# Altium project FOREIGNEXCHANGEDISPLAY.PRJPCB
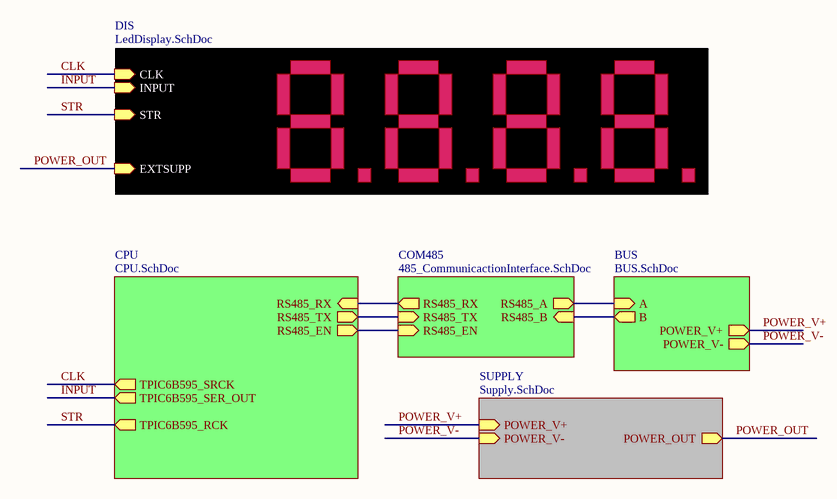
[diagram p0: BuySellDisplay.SchDoc]
13 sheets, 224 parts. Net scope: hierarchical (ports join the sheet entries above them; power ports are global).
Sheets:
  BuySellDisplay.SchDoc
    CPU = CPU.SchDoc
    COM485 = 485_CommunicactionInterface.SchDoc
    DIS = LedDisplay.SchDoc
      7SEG = Led7Seg.SchDoc
        L = Line.SchDoc
        L = Line.SchDoc
        L = Line.SchDoc
        L = Line.SchDoc
        L = Line.SchDoc
        L = Line.SchDoc
        L = Line.SchDoc
        REG = TPIC6B595_CommunicationInterface.SchDoc
      7SEG = Led7Seg.SchDoc
        L = Line.SchDoc
        L = Line.SchDoc
        L = Line.SchDoc
        L = Line.SchDoc
        L = Line.SchDoc
        L = Line.SchDoc
        L = Line.SchDoc
        REG = TPIC6B595_CommunicationInterface.SchDoc
      7SEG = Led7Seg.SchDoc
        L = Line.SchDoc
        L = Line.SchDoc
        L = Line.SchDoc
        L = Line.SchDoc
        L = Line.SchDoc
        L = Line.SchDoc
        L = Line.SchDoc
        REG = TPIC6B595_CommunicationInterface.SchDoc
      7SEG = Led7Seg.SchDoc
        L = Line.SchDoc
        L = Line.SchDoc
        L = Line.SchDoc
        L = Line.SchDoc
        L = Line.SchDoc
        L = Line.SchDoc
        L = Line.SchDoc
        REG = TPIC6B595_CommunicationInterface.SchDoc
    BUS = BUS.SchDoc
      BUS = BUSConnector.SchDoc
      BUS = BUSConnector.SchDoc
    SUPPLY = Supply.SchDoc
  SN54LS145N_CommunicationInterface.SchDoc
  Indicator.SchDoc
  Dot.SchDoc

## Sheet BuySellDisplay.SchDoc
size A4

### Sub-sheets
BUS = BUS.SchDoc: A (in), B (out), POWER_V+ (out), POWER_V- (out)
COM485 = 485_CommunicactionInterface.SchDoc: RS485_RX (out), RS485_TX (in), RS485_EN (in), RS485_A (out), RS485_B (in)
CPU = CPU.SchDoc: RS485_RX (in), RS485_TX (out), RS485_EN (out), TPIC6B595_SRCK (out), TPIC6B595_SER_OUT (out), TPIC6B595_RCK (out)
DIS = LedDisplay.SchDoc: CLK (in), INPUT (in), STR (in), EXTSUPP (in)
SUPPLY = Supply.SchDoc: POWER_V+ (in), POWER_V- (in), POWER_OUT (out)

### Nets
A: sheet COM485/RS485_A, sheet BUS/A
B: sheet COM485/RS485_B, sheet BUS/B
CLK: sheet CPU/TPIC6B595_SRCK, sheet DIS/CLK
COM_485_EN: sheet CPU/RS485_EN, sheet COM485/RS485_EN
DI: sheet CPU/RS485_TX, sheet COM485/RS485_TX
INPUT: sheet CPU/TPIC6B595_SER_OUT, sheet DIS/INPUT
POWER_OUT: sheet DIS/EXTSUPP, sheet SUPPLY/POWER_OUT  [project net EXTSUPP]
POWER_V+: sheet BUS/POWER_V+, sheet SUPPLY/POWER_V+
POWER_V-: sheet BUS/POWER_V-, sheet SUPPLY/POWER_V-
RO: sheet CPU/RS485_RX, sheet COM485/RS485_RX
STR: sheet CPU/TPIC6B595_RCK, sheet DIS/STR  [project net RCK]

## Sheet CPU.SchDoc
size A4
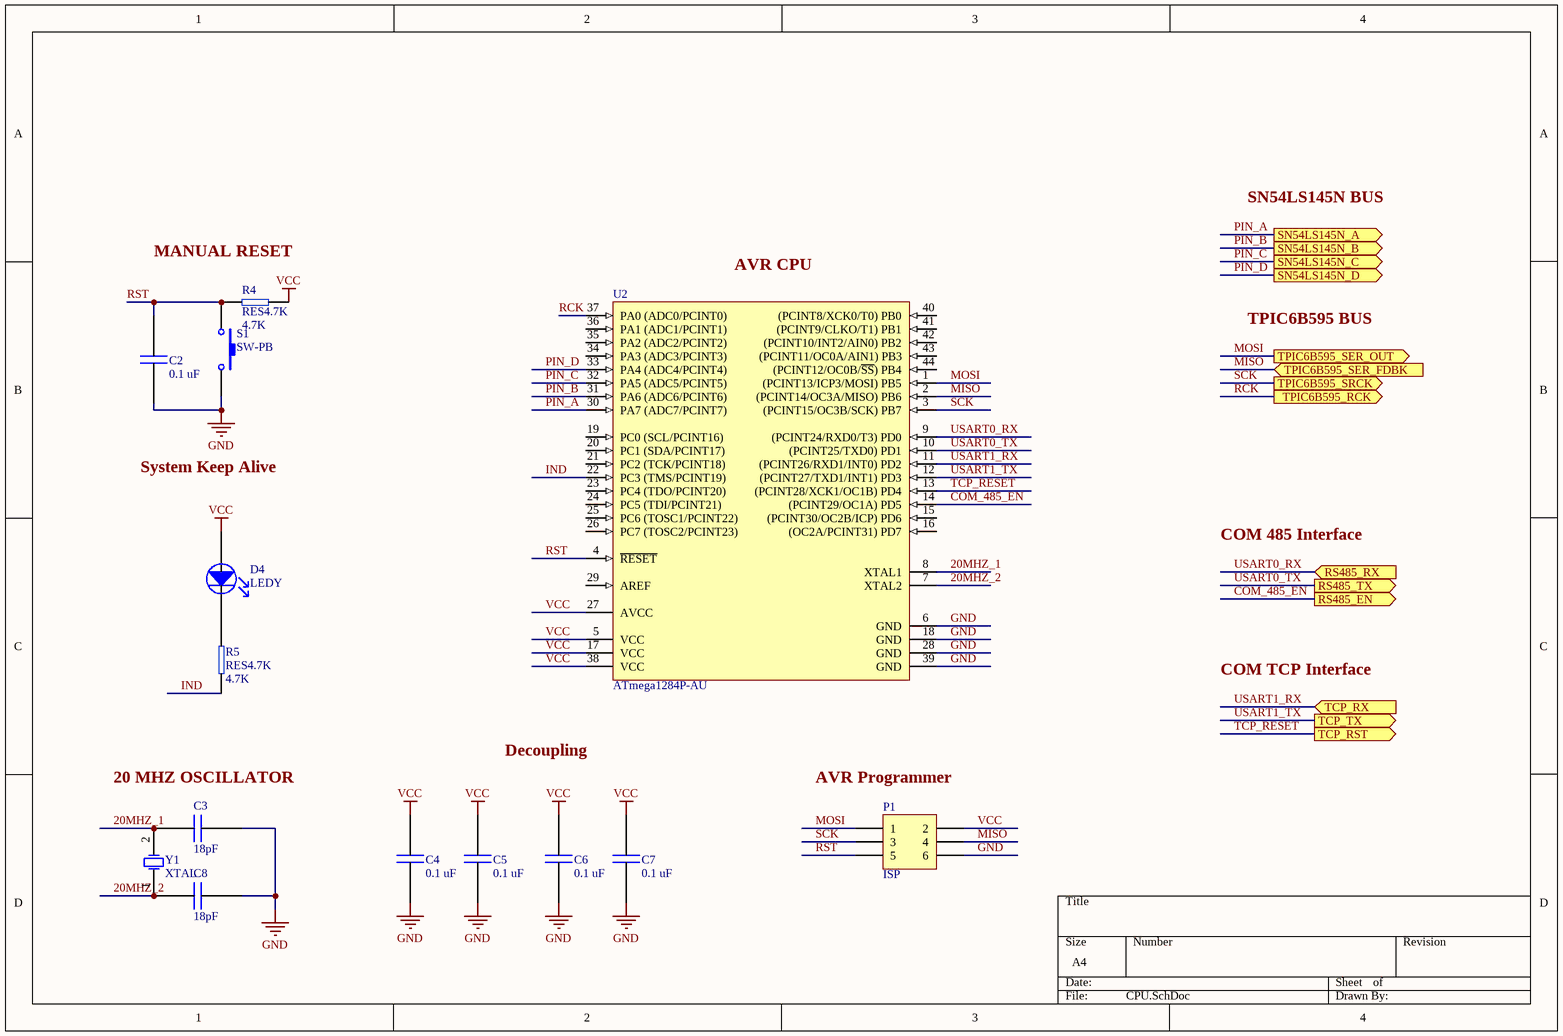
[diagram p1: CPU.SchDoc]

### Parts
C2  value 0.1 uF  [CAP0603]  (hidden comment: CAP0.1uF)
C3  value 18pF  [CAP0603]  (hidden comment: CAP18pF)
C4  value 0.1 uF  [CAP0603]  (hidden comment: CAP0.1uF)
C5  value 0.1 uF  [CAP0603]  (hidden comment: CAP0.1uF)
C6  value 0.1 uF  [CAP0603]  (hidden comment: CAP0.1uF)
C7  value 0.1 uF  [CAP0603]  (hidden comment: CAP0.1uF)
C8  value 18pF  [CAP0603]  (hidden comment: CAP18pF)
D4  LEDY  [150060YS75000]
P1  ISP  [HDR2X3]
R4  RES4.7K  value 4.7K  [RES0603]
R5  RES4.7K  value 4.7K  [RES0603]
S1  SW-PB  [microswitch]
U2  ATmega1284P-AU  [44A_N]
Y1  XTAL  [Crystal20MHz]

### Ports
RS485_EN (out), RS485_RX (in), RS485_TX (out), SN54LS145N_A (out), SN54LS145N_B (out), SN54LS145N_C (out), SN54LS145N_D (out), TCP_RST (out), TCP_RX (in), TCP_TX (out), TPIC6B595_RCK (out), TPIC6B595_SER_FDBK (in), TPIC6B595_SER_OUT (out), TPIC6B595_SRCK (out)

### Nets
GND: C2.2 C3.2 C4.2 C5.2 C6.2 C7.2 C8.2 P1.6 S1.2 U2.6(GND) U2.18(GND) U2.28(GND) U2.39(GND)
VCC: C4.1 C5.1 C6.1 C7.1 D4.2(Anode) P1.2 R4.2(neg) U2.5(VCC) U2.17(VCC) U2.27(AVCC) U2.38(VCC)
20MHZ_1: C3.1 U2.8(XTAL1) Y1.2(OSC2)
20MHZ_2: C8.1 U2.7(XTAL2) Y1.1(OSC1)
COM_485_EN: U2.14((PCINT29/OC1A)_PD5) ; port RS485_EN
IND: R5.1(pos) U2.22(PC3_(TMS/PCINT19))
MISO: P1.4 U2.2((PCINT14/OC3A/MISO)_PB6) ; port TPIC6B595_SER_FDBK
MOSI: P1.1 U2.1((PCINT13/ICP3/MOSI)_PB5) ; port TPIC6B595_SER_OUT  [project net INPUT]
PIN_A: U2.30(PA7_(ADC7/PCINT7)) ; port SN54LS145N_A
PIN_B: U2.31(PA6_(ADC6/PCINT6)) ; port SN54LS145N_B
PIN_C: U2.32(PA5_(ADC5/PCINT5)) ; port SN54LS145N_C
PIN_D: U2.33(PA4_(ADC4/PCINT4)) ; port SN54LS145N_D
RCK: U2.37(PA0_(ADC0/PCINT0)) ; port TPIC6B595_RCK
RST: C2.1 P1.5 R4.1(pos) S1.1 U2.4(~{RESET})
SCK: P1.3 U2.3((PCINT15/OC3B/SCK)_PB7) ; port TPIC6B595_SRCK  [project net CLK]
TCP_RESET: U2.13((PCINT28/XCK1/OC1B)_PD4) ; port TCP_RST
USART0_RX: U2.9((PCINT24/RXD0/T3)_PD0) ; port RS485_RX  [project net RO]
USART0_TX: U2.10((PCINT25/TXD0)_PD1) ; port RS485_TX  [project net DI]
USART1_RX: U2.11((PCINT26/RXD1/INT0)_PD2) ; port TCP_RX
USART1_TX: U2.12((PCINT27/TXD1/INT1)_PD3) ; port TCP_TX
NetD4_1: D4.1(Cathode) R5.2(neg)

Not connected (* = marked no-connect by the designer): U2 15((PCINT30/OC2B/ICP)_PD6) 16((OC2A/PCINT31)_PD7) 19(PC0_(SCL/PCINT16)) 20(PC1_(SDA/PCINT17)) 21(PC2_(TCK/PCINT18)) 23(PC4_(TDO/PCINT20)) 24(PC5_(TDI/PCINT21)) 25(PC6_(TOSC1/PCINT22)) 26(PC7_(TOSC2/PCINT23)) 29(AREF) 34(PA3_(ADC3/PCINT3)) 35(PA2_(ADC2/PCINT2)) 36(PA1_(ADC1/PCINT1)) 40((PCINT8/XCK0/T0)_PB0) 41((PCINT9/CLKO/T1)_PB1) 42((PCINT10/INT2/AIN0)_PB2) 43((PCINT11/OC0A/AIN1)_PB3) 44((PCINT12/OC0B/~{SS})_PB4)

### Notes on the sheet
- Labels drawn without touching a wire or pin: 20 MHZ OSCILLATOR, AVR CPU, AVR Programmer, COM 485 Interface, COM TCP Interface, Decoupling, MANUAL RESET, SN54LS145N BUS, System Keep Alive, TPIC6B595 BUS

### Library data of the parts
C2 C4-C7 = C0.1UF: Capacitores cerámicos de capas múltiples (MLCC) - SMD/SMT 0603 0.1uF 16volts X7R 5%; MPN: VJ0603Y104JXJPW1BC; Supplier PN: 77-VJ0603Y104JXJPBC; Supplier: Mouser
C3 C8 = CAP18pF: Capacitores cerámicos de capas múltiples (MLCC) - SMD/SMT 0603 18pF 50volts C0G 5%; MPN: GRM1885C1H180JA01D; Supplier: Mouser; Supplier PN: 81-GRM39C180J50
D4 = LEDY: LED estándar - SMD (montaje superficial) WL-SMCW SMDMono TpVw Waterclr 0603 Yellow; Supplier: Mouser; Supplier PN: 710-150060YS75000; MPN: 150060YS75000; Value: Yellow
P1 = Header 3X2: Alojamientos de cables y cabecera 2X03P DUAL ROW; MPN: 826925-3; Value: 6 POS; Supplier: Mouser; Supplier PN: 571-826925-3
R4 R5 = RES4.7K: Resistores de película gruesa - SMD 1/10watt 4.7Kohms 1%; MPN: CRCW06034K70FKEA; Supplier PN: 71-CRCW0603-4.7K-E3; Supplier: Mouser
S1 = SW-PB: Switch; MPN: PTS635SL43SMTR LFS; Value: OFF - (ON); Supplier: Mouser; Supplier PN: 611-PTS635SL43SMTRLF
U2 = ATmega1284P-AU: 20 MHz 8-bit AVR Microcontroller with 128KB Flash, 44-Pin TQFP Pkg, Industrial Temp; Supplier: Mouser; Supplier PN: 556-ATMEGA1284P-AU; MPN: ATMEGA1284P-AU; Value: ATMEGA1284P
Y1 = XTAL: Cristales 20MHz 16pF -10C +70C; MPN: ECS-200-16-5PX-TR; Supplier: Mouser; Supplier PN: 520-ECS-200-16-5PX-T; Value: 20 MHz

## Sheet 485_CommunicactionInterface.SchDoc
size A4
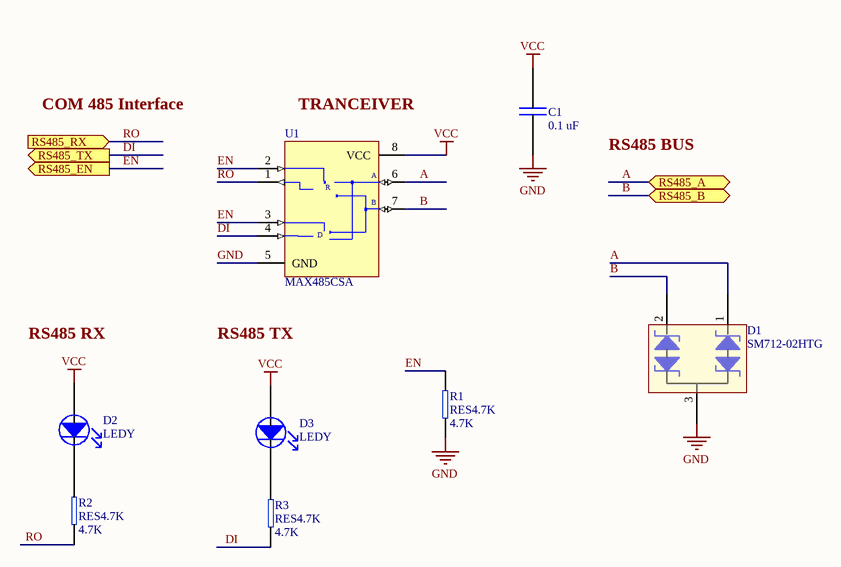
[diagram p2: 485_CommunicactionInterface.SchDoc]

### Parts
C1  value 0.1 uF  [CAP0603]  (hidden comment: CAP0.1uF)
D1  SM712-02HTG  [SW712]
D2  LEDY  [150060YS75000]
D3  LEDY  [150060YS75000]
R1  RES4.7K  value 4.7K  [RES0603]
R2  RES4.7K  value 4.7K  [RES0603]
R3  RES4.7K  value 4.7K  [RES0603]
U1  MAX485CSA  [NSO8_N]

### Ports
RS485_A (bidir), RS485_B (bidir), RS485_EN (out), RS485_RX (in), RS485_TX (out)

### Nets
GND: C1.2 D1.3 R1.2(neg) U1.5(GND)
VCC: C1.1 D2.2(Anode) D3.2(Anode) U1.8(VCC)
A: D1.1 U1.6(A) ; port RS485_A
B: D1.2 U1.7(B) ; port RS485_B
DI: R3.2(neg) U1.4(DI) ; port RS485_TX
EN: R1.1(pos) U1.2(~{RE}) U1.3(DE) ; port RS485_EN  [project net COM_485_EN]
RO: R2.2(neg) U1.1(RO) ; port RS485_RX
NetD2_1: D2.1(Cathode) R2.1(pos)
NetD3_1: D3.1(Cathode) R3.1(pos)

### Notes on the sheet
- Labels drawn without touching a wire or pin: COM 485 Interface, RS485 BUS, RS485 RX, RS485 TX, TRANCEIVER
- (in symbol MAX485CSA) R; D

### Library data of the parts
C1 = C0.1UF: as C2 on sheet CPU; Supplier PN: 77-VJ0603Y104JXJPBC; Supplier: Mouser
D1 = SM712-02HTG: Secuencias de diodos de TVS 600W 2 Channel Green Asymmetrical SOT23-3 (- 7 V to + 12 V); Supplier: Mouser; Supplier PN: 576-SM712-02HTG; MPN: SM712-02HTG; Value: TVS 600W
D2 D3 = LEDY: as D4 on sheet CPU; Supplier: Mouser; Supplier PN: 710-150060YS75000; MPN: 150060YS75000; Value: Yellow
R1-R3 = RES4.7K: as R4 on sheet CPU; Supplier PN: 71-CRCW0603-4.7K-E3; Supplier: Mouser
U1 = MAX485CSA: Low-Power, Slew-Rate-Limited RS-485/RS-422 Transceiver; MPN: MAX485CSA+; Value: RS485; Supplier: Mouser; Supplier PN: 700-MAX485CSA

## Sheet LedDisplay.SchDoc
size A4
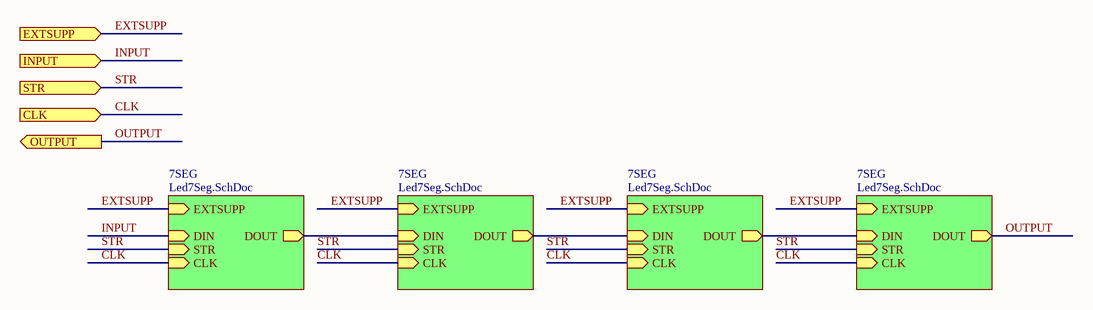
[diagram p3: LedDisplay.SchDoc]

### Sub-sheets
7SEG = Led7Seg.SchDoc: DIN (in), STR (in), CLK (in), DOUT (out), EXTSUPP (in)
7SEG = Led7Seg.SchDoc: DIN (in), STR (in), CLK (in), DOUT (out), EXTSUPP (in)
7SEG = Led7Seg.SchDoc: DIN (in), STR (in), CLK (in), DOUT (out), EXTSUPP (in)
7SEG = Led7Seg.SchDoc: DIN (in), STR (in), CLK (in), DOUT (out), EXTSUPP (in)

### Ports
CLK (in), EXTSUPP (in), INPUT (in), OUTPUT (out), STR (in)

### Nets
CLK: port CLK, sheet 7SEG/CLK, sheet 7SEG/CLK, sheet 7SEG/CLK, sheet 7SEG/CLK
EXTSUPP: port EXTSUPP, sheet 7SEG/EXTSUPP, sheet 7SEG/EXTSUPP, sheet 7SEG/EXTSUPP, sheet 7SEG/EXTSUPP
INPUT: port INPUT, sheet 7SEG/DIN
OUTPUT: port OUTPUT, sheet 7SEG/DOUT
STR: port STR, sheet 7SEG/STR, sheet 7SEG/STR, sheet 7SEG/STR, sheet 7SEG/STR  [project net RCK]
NetU3_DIS_7SEG_REG#1_9: sheet 7SEG/DOUT, sheet 7SEG/DIN
NetU3_DIS_7SEG_REG#2_9: sheet 7SEG/DOUT, sheet 7SEG/DIN
NetU3_DIS_7SEG_REG#3_9: sheet 7SEG/DOUT, sheet 7SEG/DIN

## Sheet Led7Seg.SchDoc
size A4
Used 4 times, as channels DIS/7SEG, DIS/7SEG, DIS/7SEG, DIS/7SEG. Parts and nets are listed once, with the designators drawn on the sheet.
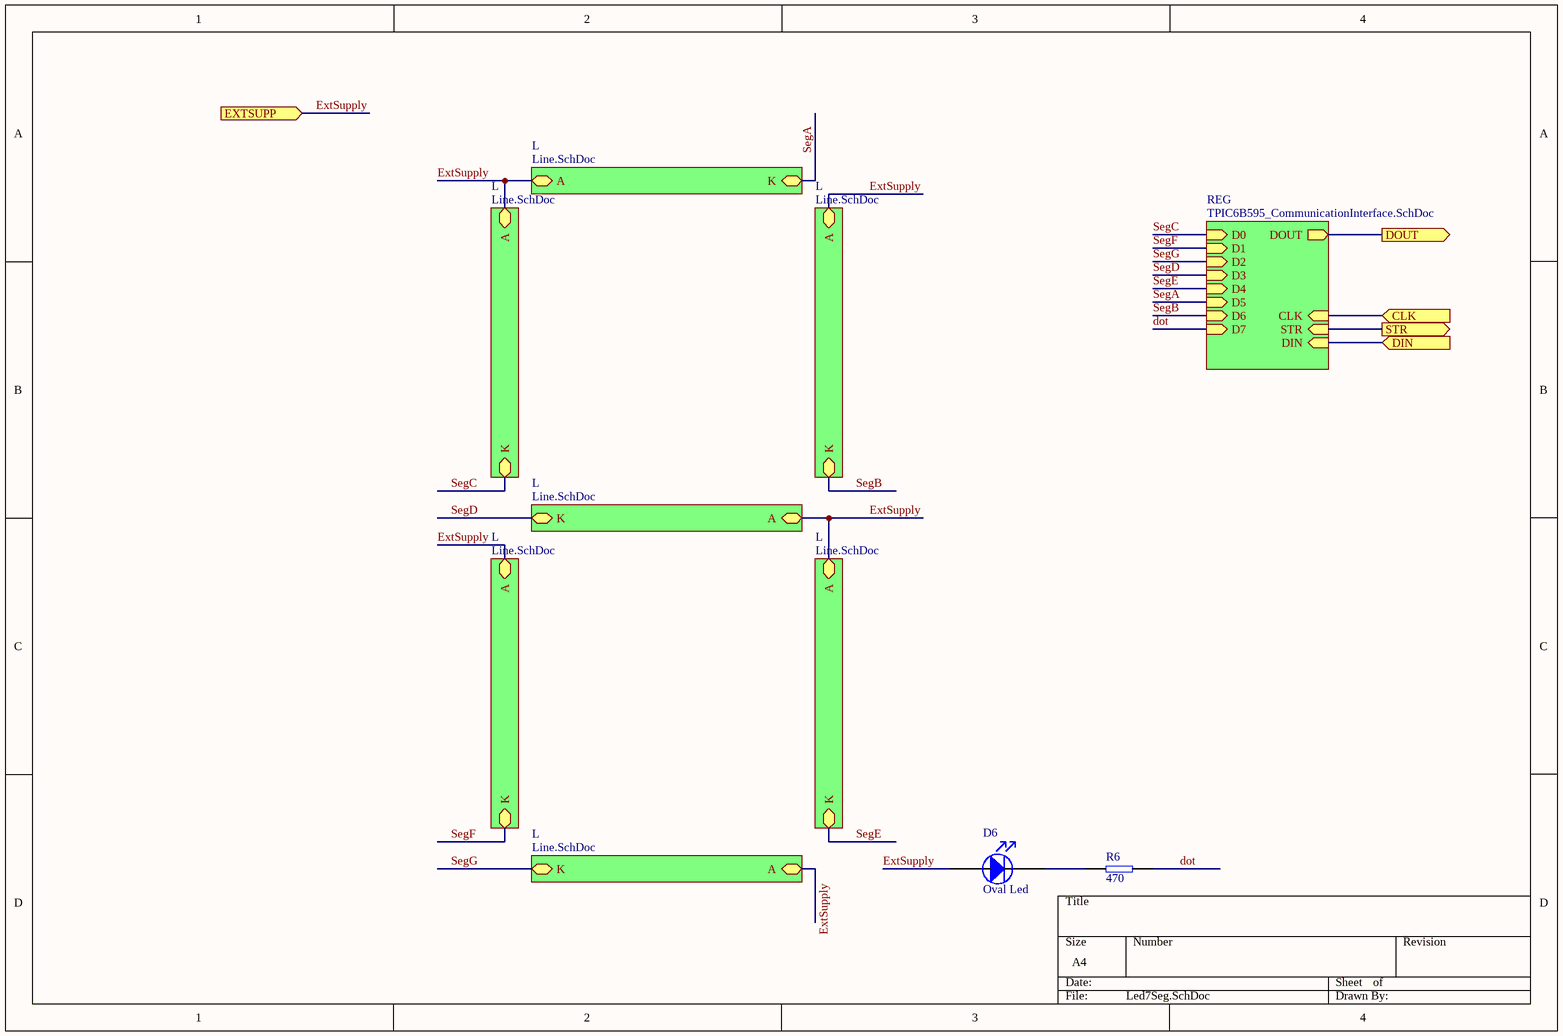
[diagram p4: Led7Seg.SchDoc]

### Parts
D6  Oval Led  [LED]
R6  value 470  [RES2512]  (hidden comment: RES470)

### Sub-sheets
L = Line.SchDoc: A, K
L = Line.SchDoc: A, K
L = Line.SchDoc: A, K
L = Line.SchDoc: A, K
L = Line.SchDoc: A, K
L = Line.SchDoc: A, K
L = Line.SchDoc: A, K
REG = TPIC6B595_CommunicationInterface.SchDoc: D0 (in), D1 (in), D2 (in), D3 (in), D4 (in), D5 (in), D6 (in), D7 (in), DIN (in), DOUT (out), STR (in), CLK (in)

### Ports
CLK (in), DIN (in), DOUT (out), EXTSUPP (in), STR (out)

### Nets
CLK: port CLK, sheet REG/CLK
DIN: port DIN, sheet REG/DIN
dot: R6.2(neg) ; sheet REG/D7
DOUT: port DOUT, sheet REG/DOUT
ExtSupply: D6.A(Anode) ; port EXTSUPP, sheet L/A, sheet L/A, sheet L/A, sheet L/A, sheet L/A, sheet L/A, sheet L/A
SegA: sheet L/K, sheet REG/D5
SegB: sheet L/K, sheet REG/D6
SegC: sheet L/K, sheet REG/D0
SegD: sheet L/K, sheet REG/D3
SegE: sheet L/K, sheet REG/D4
SegF: sheet L/K, sheet REG/D1
SegG: sheet L/K, sheet REG/D2
STR: port STR, sheet REG/STR
NetD6_K: D6.K(Cathode) R6.1(pos)

### Channels
DIS/7SEG: designators end in _DIS_7SEG#1; ports CLK=CLK DIN=INPUT DOUT=NetU3_DIS_7SEG_REG#1_9 EXTSUPP=EXTSUPP STR=RCK
DIS/7SEG: designators end in _DIS_7SEG#2; ports CLK=CLK DIN=NetU3_DIS_7SEG_REG#1_9 DOUT=NetU3_DIS_7SEG_REG#2_9 EXTSUPP=EXTSUPP STR=RCK
DIS/7SEG: designators end in _DIS_7SEG#3; ports CLK=CLK DIN=NetU3_DIS_7SEG_REG#2_9 DOUT=NetU3_DIS_7SEG_REG#3_9 EXTSUPP=EXTSUPP STR=RCK
DIS/7SEG: designators end in _DIS_7SEG#4; ports CLK=CLK DIN=NetU3_DIS_7SEG_REG#3_9 DOUT=OUTPUT EXTSUPP=EXTSUPP STR=RCK

### Library data of the parts
D6 = Oval Led: LED estándar - Montaje interfacial Red Oval LED; MPN: C566C-RFN-CV0W0BB2; Value: 2200 mcd 70x35 deg; Supplier: Mouser; Supplier PN: 941-C566CRFNCV0W0BB2
R6 = RES470: Resistores de película gruesa - SMD 1watt 470ohms 5%; MPN: CRCW2512470RJNEG; Supplier: Mouser; Supplier PN: 71-CRCW2512J-470-E3

## Sheet Line.SchDoc
size A4
Used 28 times, as channels DIS/7SEG/L, DIS/7SEG/L, DIS/7SEG/L, DIS/7SEG/L, DIS/7SEG/L, DIS/7SEG/L, DIS/7SEG/L, DIS/7SEG/L, DIS/7SEG/L, DIS/7SEG/L, DIS/7SEG/L, DIS/7SEG/L, DIS/7SEG/L, DIS/7SEG/L, DIS/7SEG/L, DIS/7SEG/L, DIS/7SEG/L, DIS/7SEG/L, DIS/7SEG/L, DIS/7SEG/L, DIS/7SEG/L, DIS/7SEG/L, DIS/7SEG/L, DIS/7SEG/L, DIS/7SEG/L, DIS/7SEG/L, DIS/7SEG/L, DIS/7SEG/L. Parts and nets are listed once, with the designators drawn on the sheet.
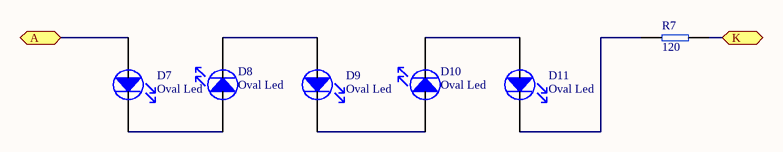
[diagram p5: Line.SchDoc]

### Parts
D7  Oval Led  [LED]
D8  Oval Led  [LED]
D9  Oval Led  [LED]
D10  Oval Led  [LED]
D11  Oval Led  [LED]
R7  value 120  [RES2512]  (hidden comment: RES120)

### Ports
A, K

### Nets
A: D7.A(Anode) ; port A
K: R7.2(neg) ; port K
NetD7_K: D7.K(Cathode) D8.A(Anode)
NetD8_K: D8.K(Cathode) D9.A(Anode)
NetD9_K: D9.K(Cathode) D10.A(Anode)
NetD10_K: D10.K(Cathode) D11.A(Anode)
NetD11_K: D11.K(Cathode) R7.1(pos)

### Channels
DIS/7SEG/L: designators end in _DIS_7SEG_L#1; ports A=EXTSUPP K=SegA_7SEG
DIS/7SEG/L: designators end in _DIS_7SEG_L#2; ports A=EXTSUPP K=SegC_7SEG
DIS/7SEG/L: designators end in _DIS_7SEG_L#3; ports A=EXTSUPP K=SegB_7SEG
DIS/7SEG/L: designators end in _DIS_7SEG_L#4; ports A=EXTSUPP K=SegD_7SEG
DIS/7SEG/L: designators end in _DIS_7SEG_L#5; ports A=EXTSUPP K=SegE_7SEG
DIS/7SEG/L: designators end in _DIS_7SEG_L#6; ports A=EXTSUPP K=SegF_7SEG
DIS/7SEG/L: designators end in _DIS_7SEG_L#7; ports A=EXTSUPP K=SegG_7SEG
DIS/7SEG/L: designators end in _DIS_7SEG_L#8; ports A=EXTSUPP K=SegA_7SEG
DIS/7SEG/L: designators end in _DIS_7SEG_L#9; ports A=EXTSUPP K=SegC_7SEG
DIS/7SEG/L: designators end in _DIS_7SEG_L#10; ports A=EXTSUPP K=SegB_7SEG
DIS/7SEG/L: designators end in _DIS_7SEG_L#11; ports A=EXTSUPP K=SegD_7SEG
DIS/7SEG/L: designators end in _DIS_7SEG_L#12; ports A=EXTSUPP K=SegE_7SEG
DIS/7SEG/L: designators end in _DIS_7SEG_L#13; ports A=EXTSUPP K=SegF_7SEG
DIS/7SEG/L: designators end in _DIS_7SEG_L#14; ports A=EXTSUPP K=SegG_7SEG
DIS/7SEG/L: designators end in _DIS_7SEG_L#15; ports A=EXTSUPP K=SegA_7SEG
DIS/7SEG/L: designators end in _DIS_7SEG_L#16; ports A=EXTSUPP K=SegC_7SEG
DIS/7SEG/L: designators end in _DIS_7SEG_L#17; ports A=EXTSUPP K=SegB_7SEG
DIS/7SEG/L: designators end in _DIS_7SEG_L#18; ports A=EXTSUPP K=SegD_7SEG
DIS/7SEG/L: designators end in _DIS_7SEG_L#19; ports A=EXTSUPP K=SegE_7SEG
DIS/7SEG/L: designators end in _DIS_7SEG_L#20; ports A=EXTSUPP K=SegF_7SEG
DIS/7SEG/L: designators end in _DIS_7SEG_L#21; ports A=EXTSUPP K=SegG_7SEG
DIS/7SEG/L: designators end in _DIS_7SEG_L#22; ports A=EXTSUPP K=SegA_7SEG
DIS/7SEG/L: designators end in _DIS_7SEG_L#23; ports A=EXTSUPP K=SegC_7SEG
DIS/7SEG/L: designators end in _DIS_7SEG_L#24; ports A=EXTSUPP K=SegB_7SEG
DIS/7SEG/L: designators end in _DIS_7SEG_L#25; ports A=EXTSUPP K=SegD_7SEG
DIS/7SEG/L: designators end in _DIS_7SEG_L#26; ports A=EXTSUPP K=SegE_7SEG
DIS/7SEG/L: designators end in _DIS_7SEG_L#27; ports A=EXTSUPP K=SegF_7SEG
DIS/7SEG/L: designators end in _DIS_7SEG_L#28; ports A=EXTSUPP K=SegG_7SEG

### Library data of the parts
D7-D11 = Oval Led: as D6 on sheet Led7Seg; Supplier: Mouser; Supplier PN: 941-C566CRFNCV0W0BB2
R7 = RES120: Resistores de película gruesa - SMD 1watt 120ohms 5%; MPN: CRCW2512120RJNEG; Supplier: Mouser; Supplier PN: 71-CRCW2512J-120-E3

## Sheet TPIC6B595_CommunicationInterface.SchDoc
size A4
Used 4 times, as channels DIS/7SEG/REG, DIS/7SEG/REG, DIS/7SEG/REG, DIS/7SEG/REG. Parts and nets are listed once, with the designators drawn on the sheet.
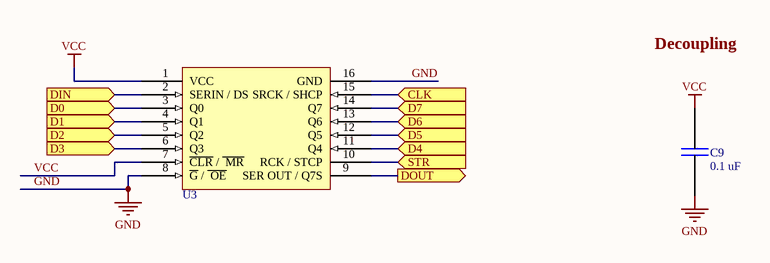
[diagram p6: TPIC6B595_CommunicationInterface.SchDoc]

### Parts
C9  value 0.1 uF  [CAP0603]  (hidden comment: CAP0.1uF)
U3  POWER SHIFT REG  [NPIC6C595_Q100_SOIC16]  (value not drawn)

### Ports
CLK (in), D0 (in), D1 (in), D2 (in), D3 (in), D4 (in), D5 (in), D6 (in), D7 (in), DIN (in), DOUT (out), STR (in)

### Nets
GND: C9.2 U3.8(~{G}_/_~{_OE}) U3.16(GND)
VCC: C9.1 U3.1(VCC) U3.7(~{CLR}_/_~{_MR})
CLK: U3.15(SRCK_/_SHCP) ; port CLK
D0: U3.3(Q0) ; port D0
D1: U3.4(Q1) ; port D1
D2: U3.5(Q2) ; port D2
D3: U3.6(Q3) ; port D3
D4: U3.11(Q4) ; port D4
D5: U3.12(Q5) ; port D5
D6: U3.13(Q6) ; port D6
D7: U3.14(Q7) ; port D7
DIN: U3.2(SERIN_/_DS) ; port DIN
DOUT: U3.9(SER_OUT_/_Q7S) ; port DOUT
STR: U3.10(RCK_/_STCP) ; port STR

### Channels
DIS/7SEG/REG: designators end in _DIS_7SEG_REG#1; ports CLK=CLK D0=SegC_7SEG D1=SegF_7SEG D2=SegG_7SEG D3=SegD_7SEG D4=SegE_7SEG D5=SegA_7SEG D6=SegB_7SEG D7=dot_7SEG DIN=INPUT DOUT=NetU3_DIS_7SEG_REG#1_9 STR=RCK
DIS/7SEG/REG: designators end in _DIS_7SEG_REG#2; ports CLK=CLK D0=SegC_7SEG D1=SegF_7SEG D2=SegG_7SEG D3=SegD_7SEG D4=SegE_7SEG D5=SegA_7SEG D6=SegB_7SEG D7=dot_7SEG DIN=NetU3_DIS_7SEG_REG#1_9 DOUT=NetU3_DIS_7SEG_REG#2_9 STR=RCK
DIS/7SEG/REG: designators end in _DIS_7SEG_REG#3; ports CLK=CLK D0=SegC_7SEG D1=SegF_7SEG D2=SegG_7SEG D3=SegD_7SEG D4=SegE_7SEG D5=SegA_7SEG D6=SegB_7SEG D7=dot_7SEG DIN=NetU3_DIS_7SEG_REG#2_9 DOUT=NetU3_DIS_7SEG_REG#3_9 STR=RCK
DIS/7SEG/REG: designators end in _DIS_7SEG_REG#4; ports CLK=CLK D0=SegC_7SEG D1=SegF_7SEG D2=SegG_7SEG D3=SegD_7SEG D4=SegE_7SEG D5=SegA_7SEG D6=SegB_7SEG D7=dot_7SEG DIN=NetU3_DIS_7SEG_REG#3_9 DOUT=OUTPUT STR=RCK

### Notes on the sheet
- Labels drawn without touching a wire or pin: Decoupling

### Library data of the parts
C9 = C0.1UF: as C2 on sheet CPU; Supplier PN: 77-VJ0603Y104JXJPBC; Supplier: Mouser
U3 = TPIC6C595DR / NPIC6C595D: Registros de cambio de contadores 8bit Shift; MPN: NPIC6C595D-Q100; Value: 8 bits shift register; Supplier: Mouser; Supplier PN: 771-NPIC6C595D-Q100; Supplier PN1: 595-TPIC6C595DR; MPN1: TPIC6C595DR

## Sheet BUS.SchDoc
size A4
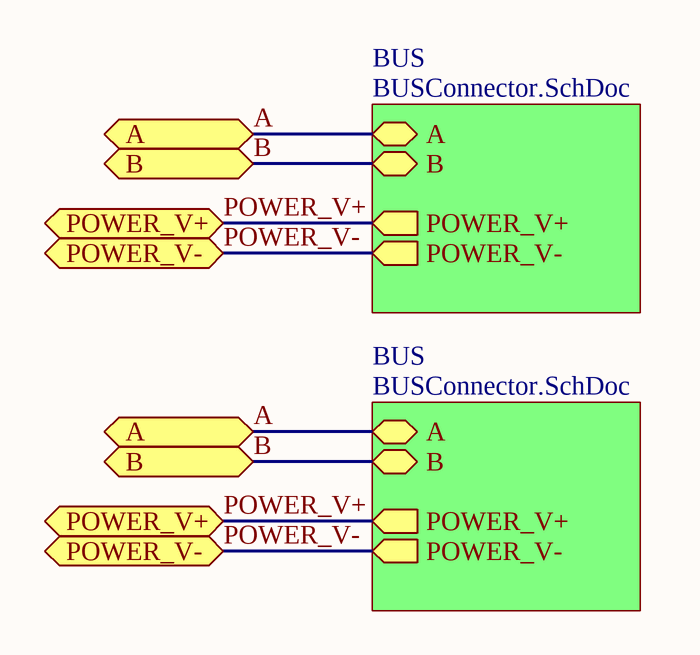
[diagram p7: BUS.SchDoc]

### Sub-sheets
BUS = BUSConnector.SchDoc: A (bidir), B (bidir), POWER_V+ (out), POWER_V- (out)
BUS = BUSConnector.SchDoc: A (bidir), B (bidir), POWER_V+ (out), POWER_V- (out)

### Ports
A, B, POWER_V+, POWER_V-

### Nets
A: port A, sheet BUS/A, sheet BUS/A
B: port B, sheet BUS/B, sheet BUS/B
POWER_V+: port POWER_V+, sheet BUS/POWER_V+, sheet BUS/POWER_V+
POWER_V-: port POWER_V-, sheet BUS/POWER_V-, sheet BUS/POWER_V-

## Sheet BUSConnector.SchDoc
size A4
Used 2 times, as channels BUS/BUS, BUS/BUS. Parts and nets are listed once, with the designators drawn on the sheet.
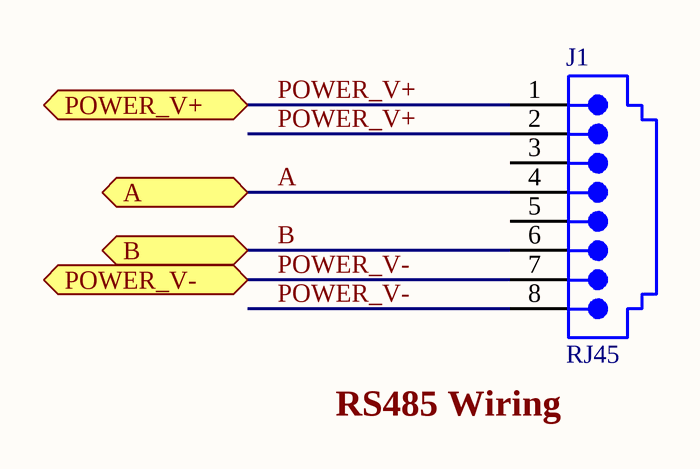
[diagram p8: BUSConnector.SchDoc]

### Parts
J1  RJ45  [15-43-6233]

### Ports
A, B, POWER_V+, POWER_V-

### Nets
A: J1.4 ; port A
B: J1.6 ; port B
POWER_V+: J1.1 J1.2 ; port POWER_V+
POWER_V-: J1.7 J1.8 ; port POWER_V-

Not connected (* = marked no-connect by the designer): J1 3 5

### Channels
BUS/BUS: designators end in _BUS_BUS#1; ports A=A B=B POWER_V+=POWER_V+ POWER_V-=POWER_V-
BUS/BUS: designators end in _BUS_BUS#2; ports A=A B=B POWER_V+=POWER_V+ POWER_V-=POWER_V-

### Notes on the sheet
- Labels drawn without touching a wire or pin: RS485 Wiring

### Library data of the parts
J1 = 15-43-6233: Conectores modulares / Conectores Ethernet 8 PCB LO PRO R/A; MPN: 5555164-1; Supplier: Mouser; Supplier PN: 571-5555164-1; Value: RJ45

## Sheet Supply.SchDoc
size A4
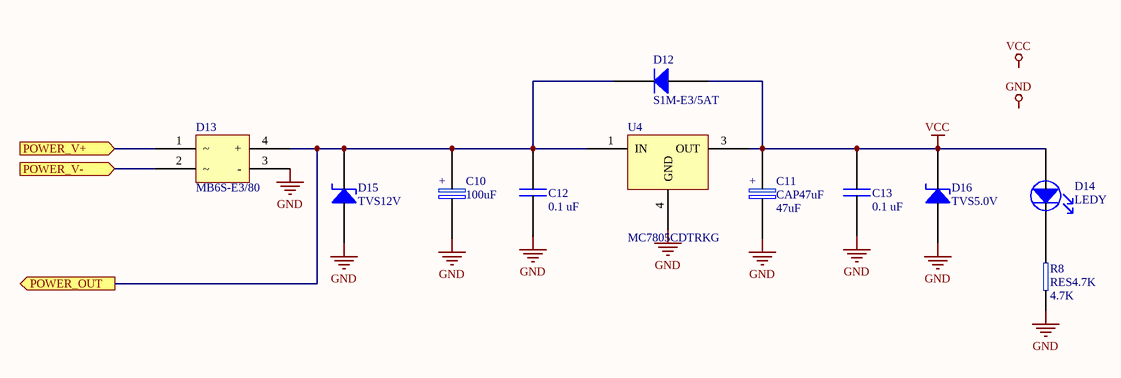
[diagram p9: Supply.SchDoc]

### Parts
C10  value 100uF  [EEH-ZA1E101XP]  (hidden comment: CAP100uF)
C11  CAP47uF  value 47uF  [EEH-ZA1E101XP]
C12  value 0.1 uF  [CAP0603]  (hidden comment: CAP0.1uF)
C13  value 0.1 uF  [CAP0603]  (hidden comment: CAP0.1uF)
D12  S1M-E3/5AT  [S1M-E3/5AT]
D13  MB6S-E3/80  [MB6S-E3/80]
D14  LEDY  [150060YS75000]
D15  TVS12V  [SMBJ5.0A]
D16  TVS5.0V  [SMBJ5.0A]
R8  RES4.7K  value 4.7K  [RES0603]
U4  MC7805CDTRKG  [MC7805CDTRKG]

### Ports
POWER_OUT (out), POWER_V+ (in), POWER_V- (in)

### Nets
GND: C10.2(neg) C11.2(neg) C12.2 C13.2 D13.3(-) D15.2(Anode) D16.2(Anode) R8.2(neg) U4.4(GND)
VCC: C11.1(pos) C13.1 D12.2(Anode) D14.2(Anode) D16.1(Cathode) U4.3(OUT)
EXTSUPP: C10.1(pos) C12.1 D12.1(Cathode) D13.4(+) D15.1(Cathode) U4.1(IN) ; port POWER_OUT
POWER_V+: D13.1 ; port POWER_V+
POWER_V-: D13.2 ; port POWER_V-
NetD14_1: D14.1(Cathode) R8.1(pos)

### Notes on the sheet
- Labels drawn without touching a wire or pin: GND, VCC
- (in symbol CAP47uF) +
- (in symbol CAP100uF) +

### Library data of the parts
C10 = CAP100uF: Capacitores de polímero orgánico de aluminio 100uF 25volts 6.3x7.7mm; Supplier: Mouser; Supplier PN: 667-EEH-ZA1E101XP; MPN: EEH-ZA1E101XP
C11 = CAP47uF: Capacitores de polímero orgánico de aluminio 25volts 47uF ESR 30mohm; MPN: 25SVPF47M; Supplier: Mouser; Supplier PN: 667-25SVPF47M
C12 C13 = C0.1UF: as C2 on sheet CPU; Supplier PN: 77-VJ0603Y104JXJPBC; Supplier: Mouser
D12 = S1M-E3/5AT: Rectificadores 1.0 Amp 1000 Volt 30A IFSM @ 8.3ms; Value: 1A; Supplier: Mouser; Supplier PN: 625-S1M-E3/5AT; MPN: S1M-E3/5AT
D13 = MB6S-E3/80: Rectificadores en puente 600 Volt 0.5 Amp 35 Amp IFSM; Value: 35V / 1A; MPN: MB6S-E3/80; Supplier: Mouser; Supplier PN: 625-MB6S-E3/80
D14 = LEDY: as D4 on sheet CPU; Supplier: Mouser; Supplier PN: 710-150060YS75000; MPN: 150060YS75000; Value: Yellow
D15 = TVS12V: Diodos TVS - Supresores de tensión transitoria 600W 12V 5% Uni; MPN: SMBJ12A-E3/52; Supplier: Mouser; Supplier PN: 625-SMBJ12A-E3; Value: 12 V
D16 = TVS5.0V: Diodos TVS - Supresores de tensión transitoria 5Vr 600W 65.3A 5% UniDirectional; Value: 5.0 V; Supplier: Mouser; Supplier PN: 576-SMBJ5.0A; MPN: SMBJ5.0A
R8 = RES4.7K: as R4 on sheet CPU; Supplier PN: 71-CRCW0603-4.7K-E3; Supplier: Mouser
U4 = MC7805CDTRKG: Reguladores de tensión lineal 5V 1A Postive; Value: 5.0 V / 1.0 A; Supplier: Mouser; Supplier PN: 863-MC7805CDTRKG; MPN: MC7805CDTRKG

## Sheet SN54LS145N_CommunicationInterface.SchDoc
size A4
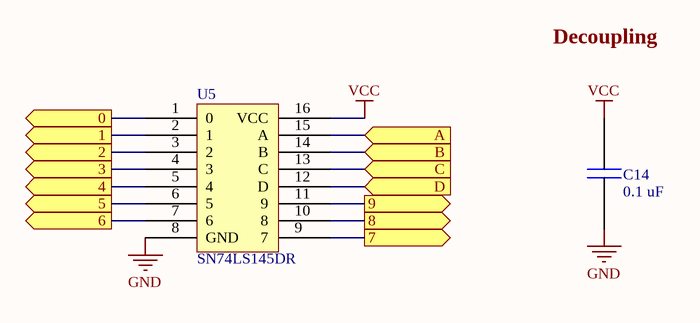
[diagram p10: SN54LS145N_CommunicationInterface.SchDoc]

### Parts
C14  value 0.1 uF  [CAP0603]  (hidden comment: CAP0.1uF)
U5  SN74LS145DR  [SOIC16]

### Ports
0 (out), 1 (out), 2 (out), 3 (out), 4 (out), 5 (out), 6 (out), 7 (out), 8 (out), 9 (out), A (in), B (in), C (in), D (in)

### Nets
GND: C14.2 U5.8(GND)
VCC: C14.1 U5.16(VCC)
NetU5_1: U5.1(0) ; port 0
NetU5_2: U5.2(1) ; port 1
NetU5_3: U5.3(2) ; port 2
NetU5_4: U5.4(3) ; port 3
NetU5_5: U5.5(4) ; port 4
NetU5_6: U5.6(5) ; port 5
NetU5_7: U5.7(6) ; port 6
NetU5_9: U5.9(7) ; port 7
NetU5_10: U5.10(8) ; port 8
NetU5_11: U5.11(9) ; port 9
NetU5_12: U5.12(D) ; port D
NetU5_13: U5.13(C) ; port C
NetU5_14: U5.14(B) ; port B
NetU5_15: U5.15(A) ; port A

### Notes on the sheet
- Labels drawn without touching a wire or pin: Decoupling

### Library data of the parts
C14 = C0.1UF: as C2 on sheet CPU; Supplier PN: 77-VJ0603Y104JXJPBC; Supplier: Mouser
U5 = SN74LS145DR: Codificadores, decodificadores, multiplexores y demultiplexores BCD-To-Decimal Decoders/Drivers; Value: BCD; Supplier: Mouser; Supplier PN: 595-SN74LS145DR; MPN: SN74LS145DR

## Sheet Indicator.SchDoc
size A4
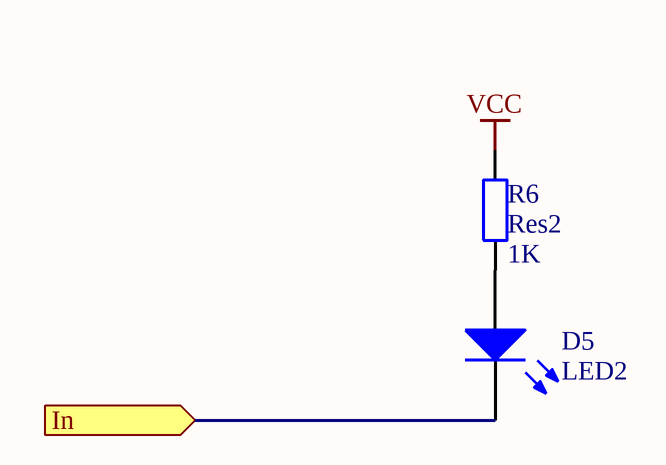
[diagram p11: Indicator.SchDoc]

### Parts
(Parts that share a designator on the sheet are numbered #1, #2 ... from top to bottom, then left to right.)
D5#1  LED2  [3.2X1.6X1.1]
R6  Res2  value 1K  [AXIAL-0.4]

### Ports
In (in)

### Nets
VCC: R6.2
NetD5#1_1: D5#1.1(A) R6.1
NetD5#1_2: D5#1.2(K) ; port In

### Library data of the parts
D5#1 = LED2: Typical RED, GREEN, YELLOW, AMBER GaAs LED; Published: 8-Jun-2000; LatestRevisionDate: 17-Jul-2002; LatestRevisionNote: Re-released for DXP Platform.; PackageDocument: Feb-2002; PackageReference: 3.2X1.6X1.1; Publisher: Altium Limited
R6 = Res2: Resistor; Published: 8-Jun-2000; LatestRevisionDate: 17-Jul-2002; LatestRevisionNote: Re-released for DXP Platform.; PackageReference: AXIAL-0.4; Publisher: Altium Limited

## Sheet Dot.SchDoc
size A4
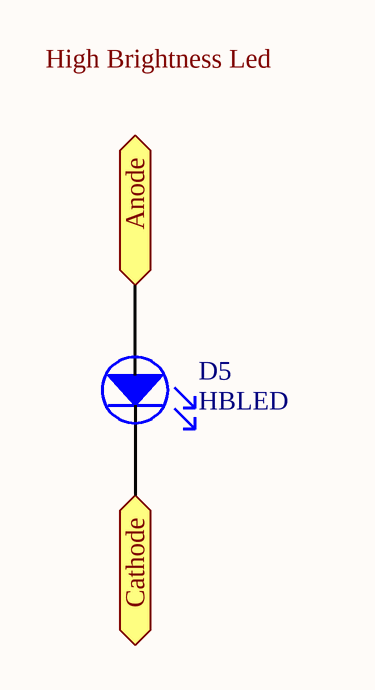
[diagram p12: Dot.SchDoc]

### Parts
(Parts that share a designator on the sheet are numbered #1, #2 ... from top to bottom, then left to right.)
D5#2  HBLED  [LED]

### Ports
Anode, Cathode

### Nets
NetD5#2_A: D5#2.A(Anode) ; port Anode
NetD5#2_K: D5#2.K(Cathode) ; port Cathode

### Notes on the sheet
- Labels drawn without touching a wire or pin: High Brightness Led

## Nets that join several sheets
GND: CPU (13 pins), 485_CommunicactionInterface (C1.2 D1.3 R1.2 U1.5), DIS/7SEG/REG (C9_DIS_7SEG_REG#1.2 U3_DIS_7SEG_REG#1.8 U3_DIS_7SEG_REG#1.16), DIS/7SEG/REG (C9_DIS_7SEG_REG#2.2 U3_DIS_7SEG_REG#2.8 U3_DIS_7SEG_REG#2.16), DIS/7SEG/REG (C9_DIS_7SEG_REG#3.2 U3_DIS_7SEG_REG#3.8 U3_DIS_7SEG_REG#3.16), DIS/7SEG/REG (C9_DIS_7SEG_REG#4.2 U3_DIS_7SEG_REG#4.8 U3_DIS_7SEG_REG#4.16), Supply (9 pins), SN54LS145N_CommunicationInterface (C14.2 U5.8)
VCC: CPU (11 pins), 485_CommunicactionInterface (C1.1 D2.2 D3.2 U1.8), DIS/7SEG/REG (C9_DIS_7SEG_REG#1.1 U3_DIS_7SEG_REG#1.1 U3_DIS_7SEG_REG#1.7), DIS/7SEG/REG (C9_DIS_7SEG_REG#2.1 U3_DIS_7SEG_REG#2.1 U3_DIS_7SEG_REG#2.7), DIS/7SEG/REG (C9_DIS_7SEG_REG#3.1 U3_DIS_7SEG_REG#3.1 U3_DIS_7SEG_REG#3.7), DIS/7SEG/REG (C9_DIS_7SEG_REG#4.1 U3_DIS_7SEG_REG#4.1 U3_DIS_7SEG_REG#4.7), Supply (6 pins), SN54LS145N_CommunicationInterface (C14.1 U5.16), Indicator (R6.2)
A: 485_CommunicactionInterface (D1.1 U1.6), BUS/BUS (J1_BUS_BUS#1.4), BUS/BUS (J1_BUS_BUS#2.4)
B: 485_CommunicactionInterface (D1.2 U1.7), BUS/BUS (J1_BUS_BUS#1.6), BUS/BUS (J1_BUS_BUS#2.6)
CLK: CPU (P1.3 U2.3), DIS/7SEG/REG (U3_DIS_7SEG_REG#1.15), DIS/7SEG/REG (U3_DIS_7SEG_REG#2.15), DIS/7SEG/REG (U3_DIS_7SEG_REG#3.15), DIS/7SEG/REG (U3_DIS_7SEG_REG#4.15)
COM_485_EN: CPU (U2.14), 485_CommunicactionInterface (R1.1 U1.2 U1.3)
DI: CPU (U2.10), 485_CommunicactionInterface (R3.2 U1.4)
dot_7SEG: DIS/7SEG (R6_DIS_7SEG#1.2), DIS/7SEG/REG (U3_DIS_7SEG_REG#1.14)
dot_7SEG: DIS/7SEG (R6_DIS_7SEG#2.2), DIS/7SEG/REG (U3_DIS_7SEG_REG#2.14)
dot_7SEG: DIS/7SEG (R6_DIS_7SEG#3.2), DIS/7SEG/REG (U3_DIS_7SEG_REG#3.14)
dot_7SEG: DIS/7SEG (R6_DIS_7SEG#4.2), DIS/7SEG/REG (U3_DIS_7SEG_REG#4.14)
EXTSUPP: DIS/7SEG (D6_DIS_7SEG#1.A), DIS/7SEG/L (D7_DIS_7SEG_L#1.A), DIS/7SEG/L (D7_DIS_7SEG_L#2.A), DIS/7SEG/L (D7_DIS_7SEG_L#3.A), DIS/7SEG/L (D7_DIS_7SEG_L#4.A), DIS/7SEG/L (D7_DIS_7SEG_L#5.A), DIS/7SEG/L (D7_DIS_7SEG_L#6.A), DIS/7SEG/L (D7_DIS_7SEG_L#7.A), DIS/7SEG (D6_DIS_7SEG#2.A), DIS/7SEG/L (D7_DIS_7SEG_L#8.A), DIS/7SEG/L (D7_DIS_7SEG_L#9.A), DIS/7SEG/L (D7_DIS_7SEG_L#10.A), DIS/7SEG/L (D7_DIS_7SEG_L#11.A), DIS/7SEG/L (D7_DIS_7SEG_L#12.A), DIS/7SEG/L (D7_DIS_7SEG_L#13.A), DIS/7SEG/L (D7_DIS_7SEG_L#14.A), DIS/7SEG (D6_DIS_7SEG#3.A), DIS/7SEG/L (D7_DIS_7SEG_L#15.A), DIS/7SEG/L (D7_DIS_7SEG_L#16.A), DIS/7SEG/L (D7_DIS_7SEG_L#17.A), DIS/7SEG/L (D7_DIS_7SEG_L#18.A), DIS/7SEG/L (D7_DIS_7SEG_L#19.A), DIS/7SEG/L (D7_DIS_7SEG_L#20.A), DIS/7SEG/L (D7_DIS_7SEG_L#21.A), DIS/7SEG (D6_DIS_7SEG#4.A), DIS/7SEG/L (D7_DIS_7SEG_L#22.A), DIS/7SEG/L (D7_DIS_7SEG_L#23.A), DIS/7SEG/L (D7_DIS_7SEG_L#24.A), DIS/7SEG/L (D7_DIS_7SEG_L#25.A), DIS/7SEG/L (D7_DIS_7SEG_L#26.A), DIS/7SEG/L (D7_DIS_7SEG_L#27.A), DIS/7SEG/L (D7_DIS_7SEG_L#28.A), Supply (6 pins)
INPUT: CPU (P1.1 U2.1), DIS/7SEG/REG (U3_DIS_7SEG_REG#1.2)
NetU3_DIS_7SEG_REG#1_9: DIS/7SEG/REG (U3_DIS_7SEG_REG#1.9), DIS/7SEG/REG (U3_DIS_7SEG_REG#2.2)
NetU3_DIS_7SEG_REG#2_9: DIS/7SEG/REG (U3_DIS_7SEG_REG#2.9), DIS/7SEG/REG (U3_DIS_7SEG_REG#3.2)
NetU3_DIS_7SEG_REG#3_9: DIS/7SEG/REG (U3_DIS_7SEG_REG#3.9), DIS/7SEG/REG (U3_DIS_7SEG_REG#4.2)
POWER_V+: BUS/BUS (J1_BUS_BUS#1.1 J1_BUS_BUS#1.2), BUS/BUS (J1_BUS_BUS#2.1 J1_BUS_BUS#2.2), Supply (D13.1)
POWER_V-: BUS/BUS (J1_BUS_BUS#1.7 J1_BUS_BUS#1.8), BUS/BUS (J1_BUS_BUS#2.7 J1_BUS_BUS#2.8), Supply (D13.2)
RCK: CPU (U2.37), DIS/7SEG/REG (U3_DIS_7SEG_REG#1.10), DIS/7SEG/REG (U3_DIS_7SEG_REG#2.10), DIS/7SEG/REG (U3_DIS_7SEG_REG#3.10), DIS/7SEG/REG (U3_DIS_7SEG_REG#4.10)
RO: CPU (U2.9), 485_CommunicactionInterface (R2.2 U1.1)
SegA_7SEG: DIS/7SEG/L (R7_DIS_7SEG_L#1.2), DIS/7SEG/REG (U3_DIS_7SEG_REG#1.12)
SegA_7SEG: DIS/7SEG/L (R7_DIS_7SEG_L#8.2), DIS/7SEG/REG (U3_DIS_7SEG_REG#2.12)
SegA_7SEG: DIS/7SEG/L (R7_DIS_7SEG_L#15.2), DIS/7SEG/REG (U3_DIS_7SEG_REG#3.12)
SegA_7SEG: DIS/7SEG/L (R7_DIS_7SEG_L#22.2), DIS/7SEG/REG (U3_DIS_7SEG_REG#4.12)
SegB_7SEG: DIS/7SEG/L (R7_DIS_7SEG_L#3.2), DIS/7SEG/REG (U3_DIS_7SEG_REG#1.13)
SegB_7SEG: DIS/7SEG/L (R7_DIS_7SEG_L#10.2), DIS/7SEG/REG (U3_DIS_7SEG_REG#2.13)
SegB_7SEG: DIS/7SEG/L (R7_DIS_7SEG_L#17.2), DIS/7SEG/REG (U3_DIS_7SEG_REG#3.13)
SegB_7SEG: DIS/7SEG/L (R7_DIS_7SEG_L#24.2), DIS/7SEG/REG (U3_DIS_7SEG_REG#4.13)
SegC_7SEG: DIS/7SEG/L (R7_DIS_7SEG_L#2.2), DIS/7SEG/REG (U3_DIS_7SEG_REG#1.3)
SegC_7SEG: DIS/7SEG/L (R7_DIS_7SEG_L#9.2), DIS/7SEG/REG (U3_DIS_7SEG_REG#2.3)
SegC_7SEG: DIS/7SEG/L (R7_DIS_7SEG_L#16.2), DIS/7SEG/REG (U3_DIS_7SEG_REG#3.3)
SegC_7SEG: DIS/7SEG/L (R7_DIS_7SEG_L#23.2), DIS/7SEG/REG (U3_DIS_7SEG_REG#4.3)
SegD_7SEG: DIS/7SEG/L (R7_DIS_7SEG_L#4.2), DIS/7SEG/REG (U3_DIS_7SEG_REG#1.6)
SegD_7SEG: DIS/7SEG/L (R7_DIS_7SEG_L#11.2), DIS/7SEG/REG (U3_DIS_7SEG_REG#2.6)
SegD_7SEG: DIS/7SEG/L (R7_DIS_7SEG_L#18.2), DIS/7SEG/REG (U3_DIS_7SEG_REG#3.6)
SegD_7SEG: DIS/7SEG/L (R7_DIS_7SEG_L#25.2), DIS/7SEG/REG (U3_DIS_7SEG_REG#4.6)
SegE_7SEG: DIS/7SEG/L (R7_DIS_7SEG_L#5.2), DIS/7SEG/REG (U3_DIS_7SEG_REG#1.11)
SegE_7SEG: DIS/7SEG/L (R7_DIS_7SEG_L#12.2), DIS/7SEG/REG (U3_DIS_7SEG_REG#2.11)
SegE_7SEG: DIS/7SEG/L (R7_DIS_7SEG_L#19.2), DIS/7SEG/REG (U3_DIS_7SEG_REG#3.11)
SegE_7SEG: DIS/7SEG/L (R7_DIS_7SEG_L#26.2), DIS/7SEG/REG (U3_DIS_7SEG_REG#4.11)
SegF_7SEG: DIS/7SEG/L (R7_DIS_7SEG_L#6.2), DIS/7SEG/REG (U3_DIS_7SEG_REG#1.4)
SegF_7SEG: DIS/7SEG/L (R7_DIS_7SEG_L#13.2), DIS/7SEG/REG (U3_DIS_7SEG_REG#2.4)
SegF_7SEG: DIS/7SEG/L (R7_DIS_7SEG_L#20.2), DIS/7SEG/REG (U3_DIS_7SEG_REG#3.4)
SegF_7SEG: DIS/7SEG/L (R7_DIS_7SEG_L#27.2), DIS/7SEG/REG (U3_DIS_7SEG_REG#4.4)
SegG_7SEG: DIS/7SEG/L (R7_DIS_7SEG_L#7.2), DIS/7SEG/REG (U3_DIS_7SEG_REG#1.5)
SegG_7SEG: DIS/7SEG/L (R7_DIS_7SEG_L#14.2), DIS/7SEG/REG (U3_DIS_7SEG_REG#2.5)
SegG_7SEG: DIS/7SEG/L (R7_DIS_7SEG_L#21.2), DIS/7SEG/REG (U3_DIS_7SEG_REG#3.5)
SegG_7SEG: DIS/7SEG/L (R7_DIS_7SEG_L#28.2), DIS/7SEG/REG (U3_DIS_7SEG_REG#4.5)